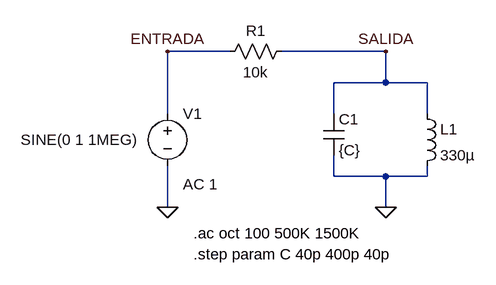
[diagram p0: schematic filtro-paso-banda-parametrico.asc]
filtro-paso-banda-parametrico.asc, the LTspice schematic file:
Version 4
SHEET 1 880 680
WIRE 96 48 0 48
WIRE 336 48 176 48
WIRE 336 96 336 48
WIRE 336 96 256 96
WIRE 400 96 336 96
WIRE 0 144 0 48
WIRE 256 144 256 96
WIRE 400 144 400 96
WIRE 256 240 256 208
WIRE 336 240 256 240
WIRE 400 240 400 224
WIRE 400 240 336 240
WIRE 0 288 0 224
WIRE 336 288 336 240
FLAG 0 288 0
FLAG 336 288 0
FLAG 0 48 ENTRADA
FLAG 336 48 SALIDA
SYMBOL cap 240 144 R0
SYMATTR InstName C1
SYMATTR Value {C}
SYMBOL ind 384 128 R0
SYMATTR InstName L1
SYMATTR Value 330µ
SYMATTR SpiceLine Rser=5
SYMBOL voltage 0 128 R0
WINDOW 123 24 124 Left 2
WINDOW 39 0 0 Left 0
WINDOW 3 -226 56 Left 2
SYMATTR Value2 AC 1
SYMATTR Value SINE(0 1 1MEG)
SYMATTR InstName V1
SYMBOL res 192 32 R90
WINDOW 0 0 56 VBottom 2
WINDOW 3 32 56 VTop 2
SYMATTR InstName R1
SYMATTR Value 10k
TEXT 40 328 Left 2 !.ac oct 100 500K 1500K
TEXT 40 360 Left 2 !.step param C 40p 400p 40p

The netlist it stands for:
* filtro-paso-banda-parametrico.asc
C1 SALIDA 0 {C}
L1 SALIDA 0 330µ Rser=5
V1 ENTRADA 0 SINE(0 1 1MEG) AC 1
R1 SALIDA ENTRADA 10k
.ac oct 100 500K 1500K
.step param C 40p 400p 40p
.backanno
.end